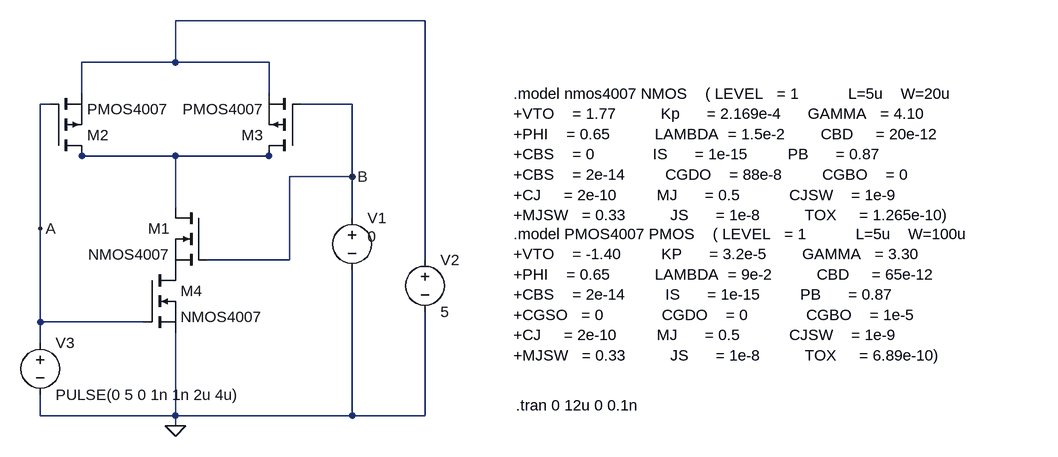
[diagram p0: schematic Practica6.3.asc]
Practica6.3.asc, the LTspice schematic file:
Version 4
SHEET 1 1556 680
WIRE 576 -128 192 -128
WIRE 192 -64 192 -128
WIRE 192 -64 48 -64
WIRE 336 -64 192 -64
WIRE 48 -16 48 -64
WIRE 336 -16 336 -64
WIRE 0 0 -16 0
WIRE 464 0 384 0
WIRE 48 80 48 64
WIRE 192 80 48 80
WIRE 336 80 336 64
WIRE 336 80 192 80
WIRE 464 112 464 0
WIRE 464 112 368 112
WIRE 192 160 192 80
WIRE 464 176 464 112
WIRE -16 192 -16 0
WIRE 368 240 368 112
WIRE 368 240 240 240
WIRE 576 240 576 -128
WIRE -16 336 -16 192
WIRE 144 336 -16 336
WIRE -16 368 -16 336
WIRE -16 480 -16 448
WIRE 192 480 192 352
WIRE 192 480 -16 480
WIRE 464 480 464 256
WIRE 464 480 192 480
WIRE 576 480 576 320
WIRE 576 480 464 480
WIRE 192 496 192 480
FLAG 192 496 0
FLAG 464 112 B
FLAG -16 192 A
SYMBOL nmos 240 160 M0
SYMATTR InstName M1
SYMATTR Value NMOS4007
SYMBOL pmos 0 80 M180
SYMATTR InstName M2
SYMATTR Value PMOS4007
SYMBOL pmos 384 80 R180
SYMATTR InstName M3
SYMATTR Value PMOS4007
SYMBOL voltage 464 160 R0
WINDOW 3 24 44 Left 2
WINDOW 123 0 0 Left 0
WINDOW 39 0 0 Left 0
SYMATTR InstName V1
SYMATTR Value 0
SYMBOL voltage 576 224 R0
WINDOW 123 0 0 Left 0
WINDOW 39 0 0 Left 0
SYMATTR InstName V2
SYMATTR Value 5
SYMBOL nmos 144 256 R0
SYMATTR InstName M4
SYMATTR Value NMOS4007
SYMBOL voltage -16 352 R0
WINDOW 123 0 0 Left 0
WINDOW 39 0 0 Left 0
SYMATTR InstName V3
SYMATTR Value PULSE(0 5 0 1n 1n 2u 4u)
TEXT 712 -16 Left 2 !.model nmos4007 NMOS    ( LEVEL   = 1           L=5u    W=20u             \n+VTO    = 1.77          Kp      = 2.169e-4      GAMMA   = 4.10  \n+PHI    = 0.65          LAMBDA  = 1.5e-2        CBD     = 20e-12\n+CBS    = 0             IS      = 1e-15         PB      = 0.87\n+CBS    = 2e-14         CGDO    = 88e-8         CGBO    = 0\n+CJ     = 2e-10         MJ      = 0.5           CJSW    = 1e-9\n+MJSW   = 0.33          JS      = 1e-8          TOX     = 1.265e-10)
TEXT 712 200 Left 2 !.model PMOS4007 PMOS    ( LEVEL   = 1           L=5u    W=100u                \n+VTO    = -1.40         KP      = 3.2e-5        GAMMA   = 3.30  \n+PHI    = 0.65          LAMBDA  = 9e-2          CBD     = 65e-12\n+CBS    = 2e-14         IS      = 1e-15         PB      = 0.87\n+CGSO   = 0             CGDO    = 0             CGBO    = 1e-5\n+CJ     = 2e-10         MJ      = 0.5           CJSW    = 1e-9\n+MJSW   = 0.33          JS      = 1e-8          TOX     = 6.89e-10)
TEXT 716 464 Left 2 !.tran 0 12u 0 0.1n

The netlist it stands for:
* Practica6.3.asc
M1 N002 B P001 P001 NMOS4007
M2 N002 A N001 N001 PMOS4007
M3 N002 B N001 N001 PMOS4007
V1 B 0 0
V2 N001 0 5
M4 P001 A 0 0 NMOS4007
V3 A 0 PULSE(0 5 0 1n 1n 2u 4u)
.model NMOS NMOS
.model PMOS PMOS
.lib standard.mos
.model nmos4007 NMOS    ( LEVEL   = 1           L=5u    W=20u
+VTO    = 1.77          Kp      = 2.169e-4      GAMMA   = 4.10
+PHI    = 0.65          LAMBDA  = 1.5e-2        CBD     = 20e-12
+CBS    = 0             IS      = 1e-15         PB      = 0.87
+CBS    = 2e-14         CGDO    = 88e-8         CGBO    = 0
+CJ     = 2e-10         MJ      = 0.5           CJSW    = 1e-9
+MJSW   = 0.33          JS      = 1e-8          TOX     = 1.265e-10)
.model PMOS4007 PMOS    ( LEVEL   = 1           L=5u    W=100u
+VTO    = -1.40         KP      = 3.2e-5        GAMMA   = 3.30
+PHI    = 0.65          LAMBDA  = 9e-2          CBD     = 65e-12
+CBS    = 2e-14         IS      = 1e-15         PB      = 0.87
+CGSO   = 0             CGDO    = 0             CGBO    = 1e-5
+CJ     = 2e-10         MJ      = 0.5           CJSW    = 1e-9
+MJSW   = 0.33          JS      = 1e-8          TOX     = 6.89e-10)
.tran 0 12u 0 0.1n
.backanno
.end